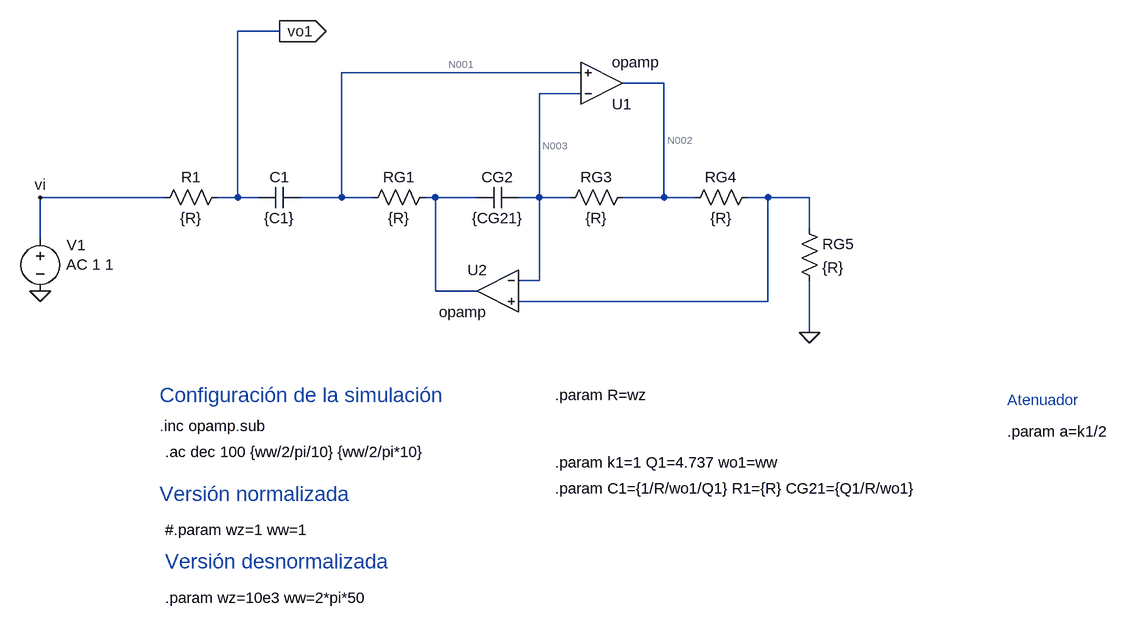
[diagram p0: schematic GIC notch 50Hz.asc]
GIC notch 50Hz.asc, the LTspice schematic file:
Version 4
SHEET 1 2616 808
WIRE 16 -80 -48 -80
WIRE 480 -16 112 -16
WIRE 608 0 544 0
WIRE 480 16 416 16
WIRE -160 176 -352 176
WIRE -48 176 -48 -80
WIRE -48 176 -80 176
WIRE -16 176 -48 176
WIRE 112 176 112 -16
WIRE 112 176 48 176
WIRE 160 176 112 176
WIRE 256 176 240 176
WIRE 320 176 256 176
WIRE 416 176 416 16
WIRE 416 176 384 176
WIRE 464 176 416 176
WIRE 608 176 608 0
WIRE 608 176 544 176
WIRE 656 176 608 176
WIRE 768 176 736 176
WIRE 832 176 768 176
WIRE 832 224 832 176
WIRE -352 240 -352 176
WIRE 416 304 416 176
WIRE 416 304 384 304
WIRE 256 320 256 176
WIRE 320 320 256 320
WIRE 768 336 768 176
WIRE 768 336 384 336
WIRE 832 384 832 304
FLAG 832 384 0
FLAG -352 320 0
FLAG -352 176 vi
FLAG 16 -80 vo1
IOPIN 16 -80 Out
SYMBOL res -64 160 R90
WINDOW 0 0 56 VBottom 2
WINDOW 3 32 56 VTop 2
SYMATTR InstName R1
SYMATTR Value {R}
SYMBOL res 144 192 R270
WINDOW 0 32 56 VTop 2
WINDOW 3 0 56 VBottom 2
SYMATTR InstName RG1
SYMATTR Value {R}
SYMBOL res 448 192 R270
WINDOW 0 32 56 VTop 2
WINDOW 3 0 56 VBottom 2
SYMATTR InstName RG3
SYMATTR Value {R}
SYMBOL res 640 192 R270
WINDOW 0 32 56 VTop 2
WINDOW 3 0 56 VBottom 2
SYMATTR InstName RG4
SYMATTR Value {R}
SYMBOL res 816 208 R0
SYMATTR InstName RG5
SYMATTR Value {R}
SYMBOL cap -16 192 R270
WINDOW 0 32 32 VTop 2
WINDOW 3 0 32 VBottom 2
SYMATTR InstName C1
SYMATTR Value {C1}
SYMBOL cap 320 192 R270
WINDOW 0 32 32 VTop 2
WINDOW 3 0 32 VBottom 2
SYMATTR InstName CG2
SYMATTR Value {CG21}
SYMBOL OpAmps\\opamp 512 64 M180
SYMATTR InstName U1
SYMBOL OpAmps\\opamp 352 256 M0
SYMATTR InstName U2
SYMBOL voltage -352 224 R0
WINDOW 123 40 55 Left 2
WINDOW 39 0 0 Left 0
WINDOW 0 41 25 Left 2
SYMATTR Value2 AC 1 1
SYMATTR InstName V1
SYMATTR Value ""
TEXT -168 528 Left 2 !.inc opamp.sub
TEXT -160 568 Left 2 !.ac dec 100 {ww/2/pi/10} {ww/2/pi*10}
TEXT 440 584 Left 2 !.param k1=1 Q1=4.737 wo1=ww
TEXT -160 792 Left 2 !.param wz=10e3 ww=2*pi*50
TEXT -168 632 Left 3 ;Versión normalizada
TEXT -160 736 Left 3 ;Versión desnormalizada
TEXT 440 624 Left 2 !.param C1={1/R/wo1/Q1} R1={R} CG21={Q1/R/wo1}
TEXT -160 688 Left 2 !#.param wz=1 ww=1
TEXT 440 480 Left 2 !.param R=wz
TEXT -168 480 Left 3 ;Configuración de la simulación
TEXT 1136 488 Left 2 ;Atenuador
TEXT 1136 536 Left 2 !.param a=k1/2

The netlist it stands for:
* GIC notch 50Hz.asc
R1 vo1 vi {R}
RG1 N001 N004 {R}
RG3 N003 N002 {R}
RG4 N002 N005 {R}
RG5 N005 0 {R}
C1 vo1 N001 {C1}
CG2 N004 N003 {CG21}
XU1 N003 N001 N002 opamp Aol=100K GBW=10Meg  ; pins invin noninvin out
XU2 N003 N005 N004 opamp Aol=100K GBW=10Meg  ; pins invin noninvin out
V1 vi 0 AC 1 1
.inc opamp.sub
.ac dec 100 {ww/2/pi/10} {ww/2/pi*10}
.param k1=1 Q1=4.737 wo1=ww
.param wz=10e3 ww=2*pi*50
* Versión normalizada
* Versión desnormalizada
.param C1={1/R/wo1/Q1} R1={R} CG21={Q1/R/wo1}
#.param wz=1 ww=1
.param R=wz
* Configuración de la simulación
* Atenuador
.param a=k1/2
.backanno
.end

* Results of the author's LTspice run, read from the files saved beside the schematic
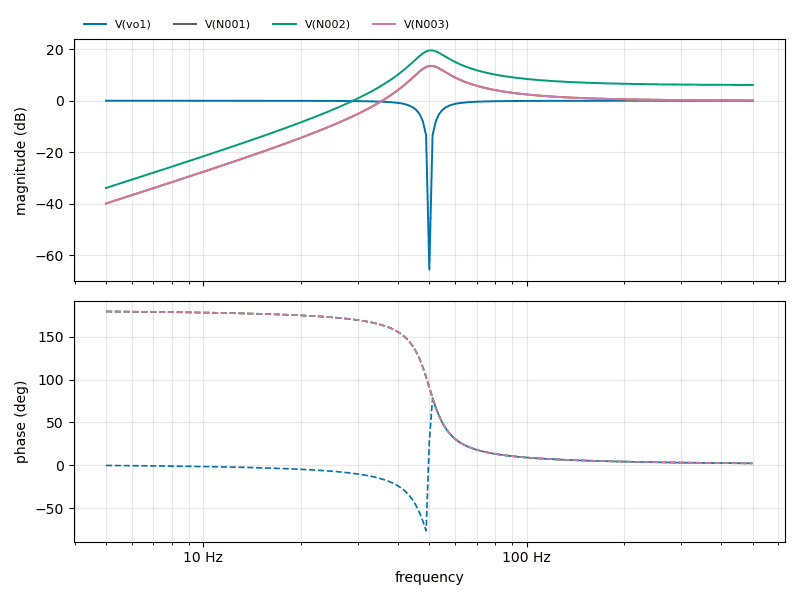
[diagram p1: AC Analysis of GIC notch 50Hz.asc, plotted from the saved traces]
* AC Analysis, 1 run:
*   V(vo1): -0.00 dB at 5 Hz, -0.00 dB at 500 Hz, peak -0.00 dB at 5 Hz, 3 dB below the peak at 44.94 Hz
*   V(N001): -39.91 dB at 5 Hz, 0.08 dB at 500 Hz, peak 13.51 dB at 50 Hz, 3 dB below the peak at 45.84 Hz and 57.16 Hz
*   V(N002): -33.89 dB at 5 Hz, 6.11 dB at 500 Hz, peak 19.53 dB at 50 Hz, 3 dB below the peak at 45.84 Hz and 57.16 Hz
*   V(N003): -39.91 dB at 5 Hz, 0.08 dB at 500 Hz, peak 13.51 dB at 50 Hz, 3 dB below the peak at 45.84 Hz and 57.16 Hz